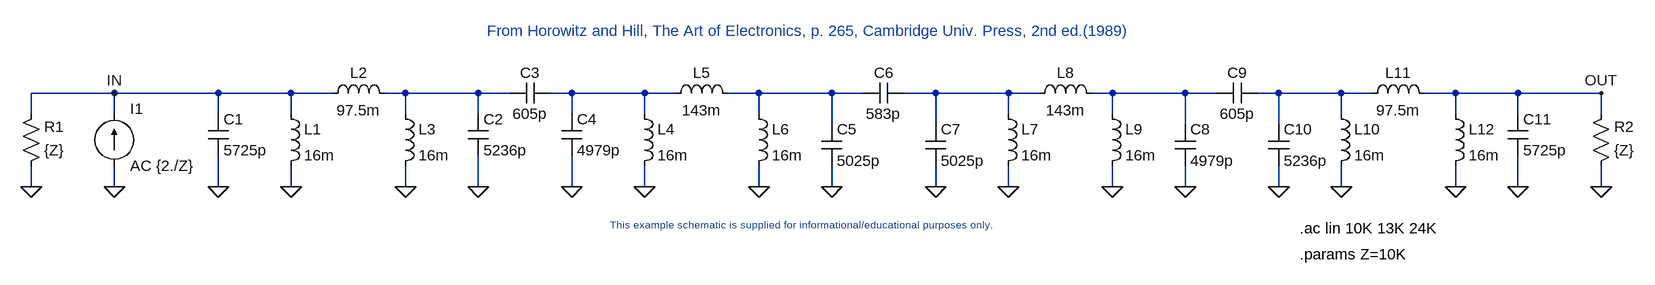
[diagram p0: schematic passive.asc]
passive.asc, the LTspice schematic file:
Version 4
SHEET 1 5945676 13421556
WIRE 1568 64 1440 64
WIRE 1728 64 1568 64
WIRE 1840 64 1728 64
WIRE 1904 64 1840 64
WIRE 2016 64 1984 64
WIRE 2128 64 2016 64
WIRE 2176 64 2128 64
WIRE 2272 64 2240 64
WIRE 2384 64 2272 64
WIRE 2432 64 2384 64
WIRE 2560 64 2512 64
WIRE 2672 64 2560 64
WIRE 2720 64 2672 64
WIRE 2832 64 2784 64
WIRE 2944 64 2832 64
WIRE 2992 64 2944 64
WIRE 3104 64 3072 64
WIRE 3216 64 3104 64
WIRE 3264 64 3216 64
WIRE 3360 64 3328 64
WIRE 3456 64 3360 64
WIRE 3504 64 3456 64
WIRE 3632 64 3584 64
WIRE 3728 64 3632 64
WIRE 3856 64 3728 64
WIRE 1440 96 1440 64
WIRE 1568 96 1568 64
WIRE 1728 96 1728 64
WIRE 1840 96 1840 64
WIRE 2016 96 2016 64
WIRE 2128 96 2128 64
WIRE 2272 96 2272 64
WIRE 2384 96 2384 64
WIRE 2560 96 2560 64
WIRE 2944 96 2944 64
WIRE 3104 96 3104 64
WIRE 3456 96 3456 64
WIRE 3632 96 3632 64
WIRE 3728 96 3728 64
WIRE 3856 96 3856 64
WIRE 2672 112 2672 64
WIRE 2832 112 2832 64
WIRE 3216 112 3216 64
WIRE 3360 112 3360 64
WIRE 1440 208 1440 176
WIRE 1568 208 1568 176
WIRE 1728 208 1728 160
WIRE 1840 208 1840 176
WIRE 2016 208 2016 176
WIRE 2128 208 2128 160
WIRE 2272 208 2272 160
WIRE 2384 208 2384 176
WIRE 2560 208 2560 176
WIRE 2672 208 2672 176
WIRE 2832 208 2832 176
WIRE 2944 208 2944 176
WIRE 3104 208 3104 176
WIRE 3216 208 3216 176
WIRE 3360 208 3360 176
WIRE 3456 208 3456 176
WIRE 3632 208 3632 176
WIRE 3728 208 3728 160
WIRE 3856 208 3856 176
FLAG 1568 208 0
FLAG 1728 208 0
FLAG 1840 208 0
FLAG 1440 208 0
FLAG 2016 208 0
FLAG 3360 208 0
FLAG 2272 208 0
FLAG 2384 208 0
FLAG 2560 208 0
FLAG 2672 208 0
FLAG 2832 208 0
FLAG 2944 208 0
FLAG 3104 208 0
FLAG 3216 208 0
FLAG 3456 208 0
FLAG 3632 208 0
FLAG 3728 208 0
FLAG 3856 208 0
FLAG 2128 208 0
FLAG 1568 64 IN
FLAG 3856 64 OUT
SYMBOL RES 1424 192 M180
WINDOW 0 36 76 Left 2
WINDOW 3 36 40 Left 2
SYMATTR InstName R1
SYMATTR Value {Z}
SYMBOL cap 1712 96 R0
SYMATTR InstName C1
SYMATTR Value 5725p
SYMBOL ind 1824 80 R0
SYMATTR InstName L1
SYMATTR Value 16m
SYMBOL CURRENT 1568 176 M180
WINDOW 0 24 88 Left 2
WINDOW 3 24 0 Left 2
SYMATTR InstName I1
SYMATTR Value AC {2./Z}
SYMBOL ind 1888 80 R270
WINDOW 0 32 56 VTop 2
WINDOW 3 5 56 VBottom 2
SYMATTR InstName L2
SYMATTR Value 97.5m
SYMBOL ind 2000 80 R0
SYMATTR InstName L3
SYMATTR Value 16m
SYMBOL cap 3344 112 R0
SYMATTR InstName C10
SYMATTR Value 5236p
SYMBOL cap 2256 96 R0
SYMATTR InstName C4
SYMATTR Value 4979p
SYMBOL ind 2368 80 R0
SYMATTR InstName L4
SYMATTR Value 16m
SYMBOL ind 2416 80 R270
WINDOW 0 32 56 VTop 2
WINDOW 3 5 56 VBottom 2
SYMATTR InstName L5
SYMATTR Value 143m
SYMBOL ind 2544 80 R0
SYMATTR InstName L6
SYMATTR Value 16m
SYMBOL cap 2656 112 R0
SYMATTR InstName C5
SYMATTR Value 5025p
SYMBOL cap 2240 48 R90
WINDOW 0 0 32 VBottom 2
WINDOW 3 32 32 VTop 2
SYMATTR InstName C3
SYMATTR Value 605p
SYMBOL cap 2784 48 R90
WINDOW 0 0 32 VBottom 2
WINDOW 3 32 32 VTop 2
SYMATTR InstName C6
SYMATTR Value 583p
SYMBOL cap 2816 112 R0
SYMATTR InstName C7
SYMATTR Value 5025p
SYMBOL ind 2928 80 R0
SYMATTR InstName L7
SYMATTR Value 16m
SYMBOL ind 2976 80 R270
WINDOW 0 32 56 VTop 2
WINDOW 3 5 56 VBottom 2
SYMATTR InstName L8
SYMATTR Value 143m
SYMBOL ind 3088 80 R0
SYMATTR InstName L9
SYMATTR Value 16m
SYMBOL cap 3200 112 R0
SYMATTR InstName C8
SYMATTR Value 4979p
SYMBOL cap 3328 48 R90
WINDOW 0 0 32 VBottom 2
WINDOW 3 32 32 VTop 2
SYMATTR InstName C9
SYMATTR Value 605p
SYMBOL ind 3440 80 R0
SYMATTR InstName L10
SYMATTR Value 16m
SYMBOL ind 3488 80 R270
WINDOW 0 32 56 VTop 2
WINDOW 3 5 56 VBottom 2
SYMATTR InstName L11
SYMATTR Value 97.5m
SYMBOL ind 3616 80 R0
SYMATTR InstName L12
SYMATTR Value 16m
SYMBOL res 3840 192 M180
WINDOW 0 36 76 Left 2
WINDOW 3 36 40 Left 2
SYMATTR InstName R2
SYMATTR Value {Z}
SYMBOL cap 3712 96 R0
SYMATTR InstName C11
SYMATTR Value 5725p
SYMBOL cap 2112 96 R0
SYMATTR InstName C2
SYMATTR Value 5236p
TEXT 3392 272 Left 2 !.ac lin 10K 13K 24K
TEXT 3392 312 Left 2 !.params Z=10K
TEXT 2640 -16 Bottom 2 ;From Horowitz and Hill, The Art of Electronics, p. 265, Cambridge Univ. Press, 2nd ed.(1989)
TEXT 2616 256 Top 1 ;This example schematic is supplied for informational/educational purposes only.

The netlist it stands for:
* passive.asc
R1 0 IN {Z}
C1 IN 0 5725p
L1 IN 0 16m
I1 0 IN AC {2./Z}
L2 IN N001 97.5m
L3 N001 0 16m
C10 N006 0 5236p
C4 N002 0 4979p
L4 N002 0 16m
L5 N002 N003 143m
L6 N003 0 16m
C5 N003 0 5025p
C3 N002 N001 605p
C6 N004 N003 583p
C7 N004 0 5025p
L7 N004 0 16m
L8 N004 N005 143m
L9 N005 0 16m
C8 N005 0 4979p
C9 N006 N005 605p
L10 N006 0 16m
L11 N006 OUT 97.5m
L12 OUT 0 16m
R2 0 OUT {Z}
C11 OUT 0 5725p
C2 N001 0 5236p
.ac lin 10K 13K 24K
.params Z=10K
* From Horowitz and Hill, The Art of Electronics, p. 265, Cambridge Univ. Press, 2nd ed.(1989)
* This example schematic is supplied for informational/educational purposes only.
.backanno
.end